# EasyEDA Pro project myg102.eprj

# Schematic Schematic1
Board Name: Board1; Create Date: 2025-02-24; Page Name: P1; Project Name: myg102; Schematic Name: Schematic1; Update Date: 2025-06-20; Company: 嘉立创EDA; Page Size: A4; Version: V1.0
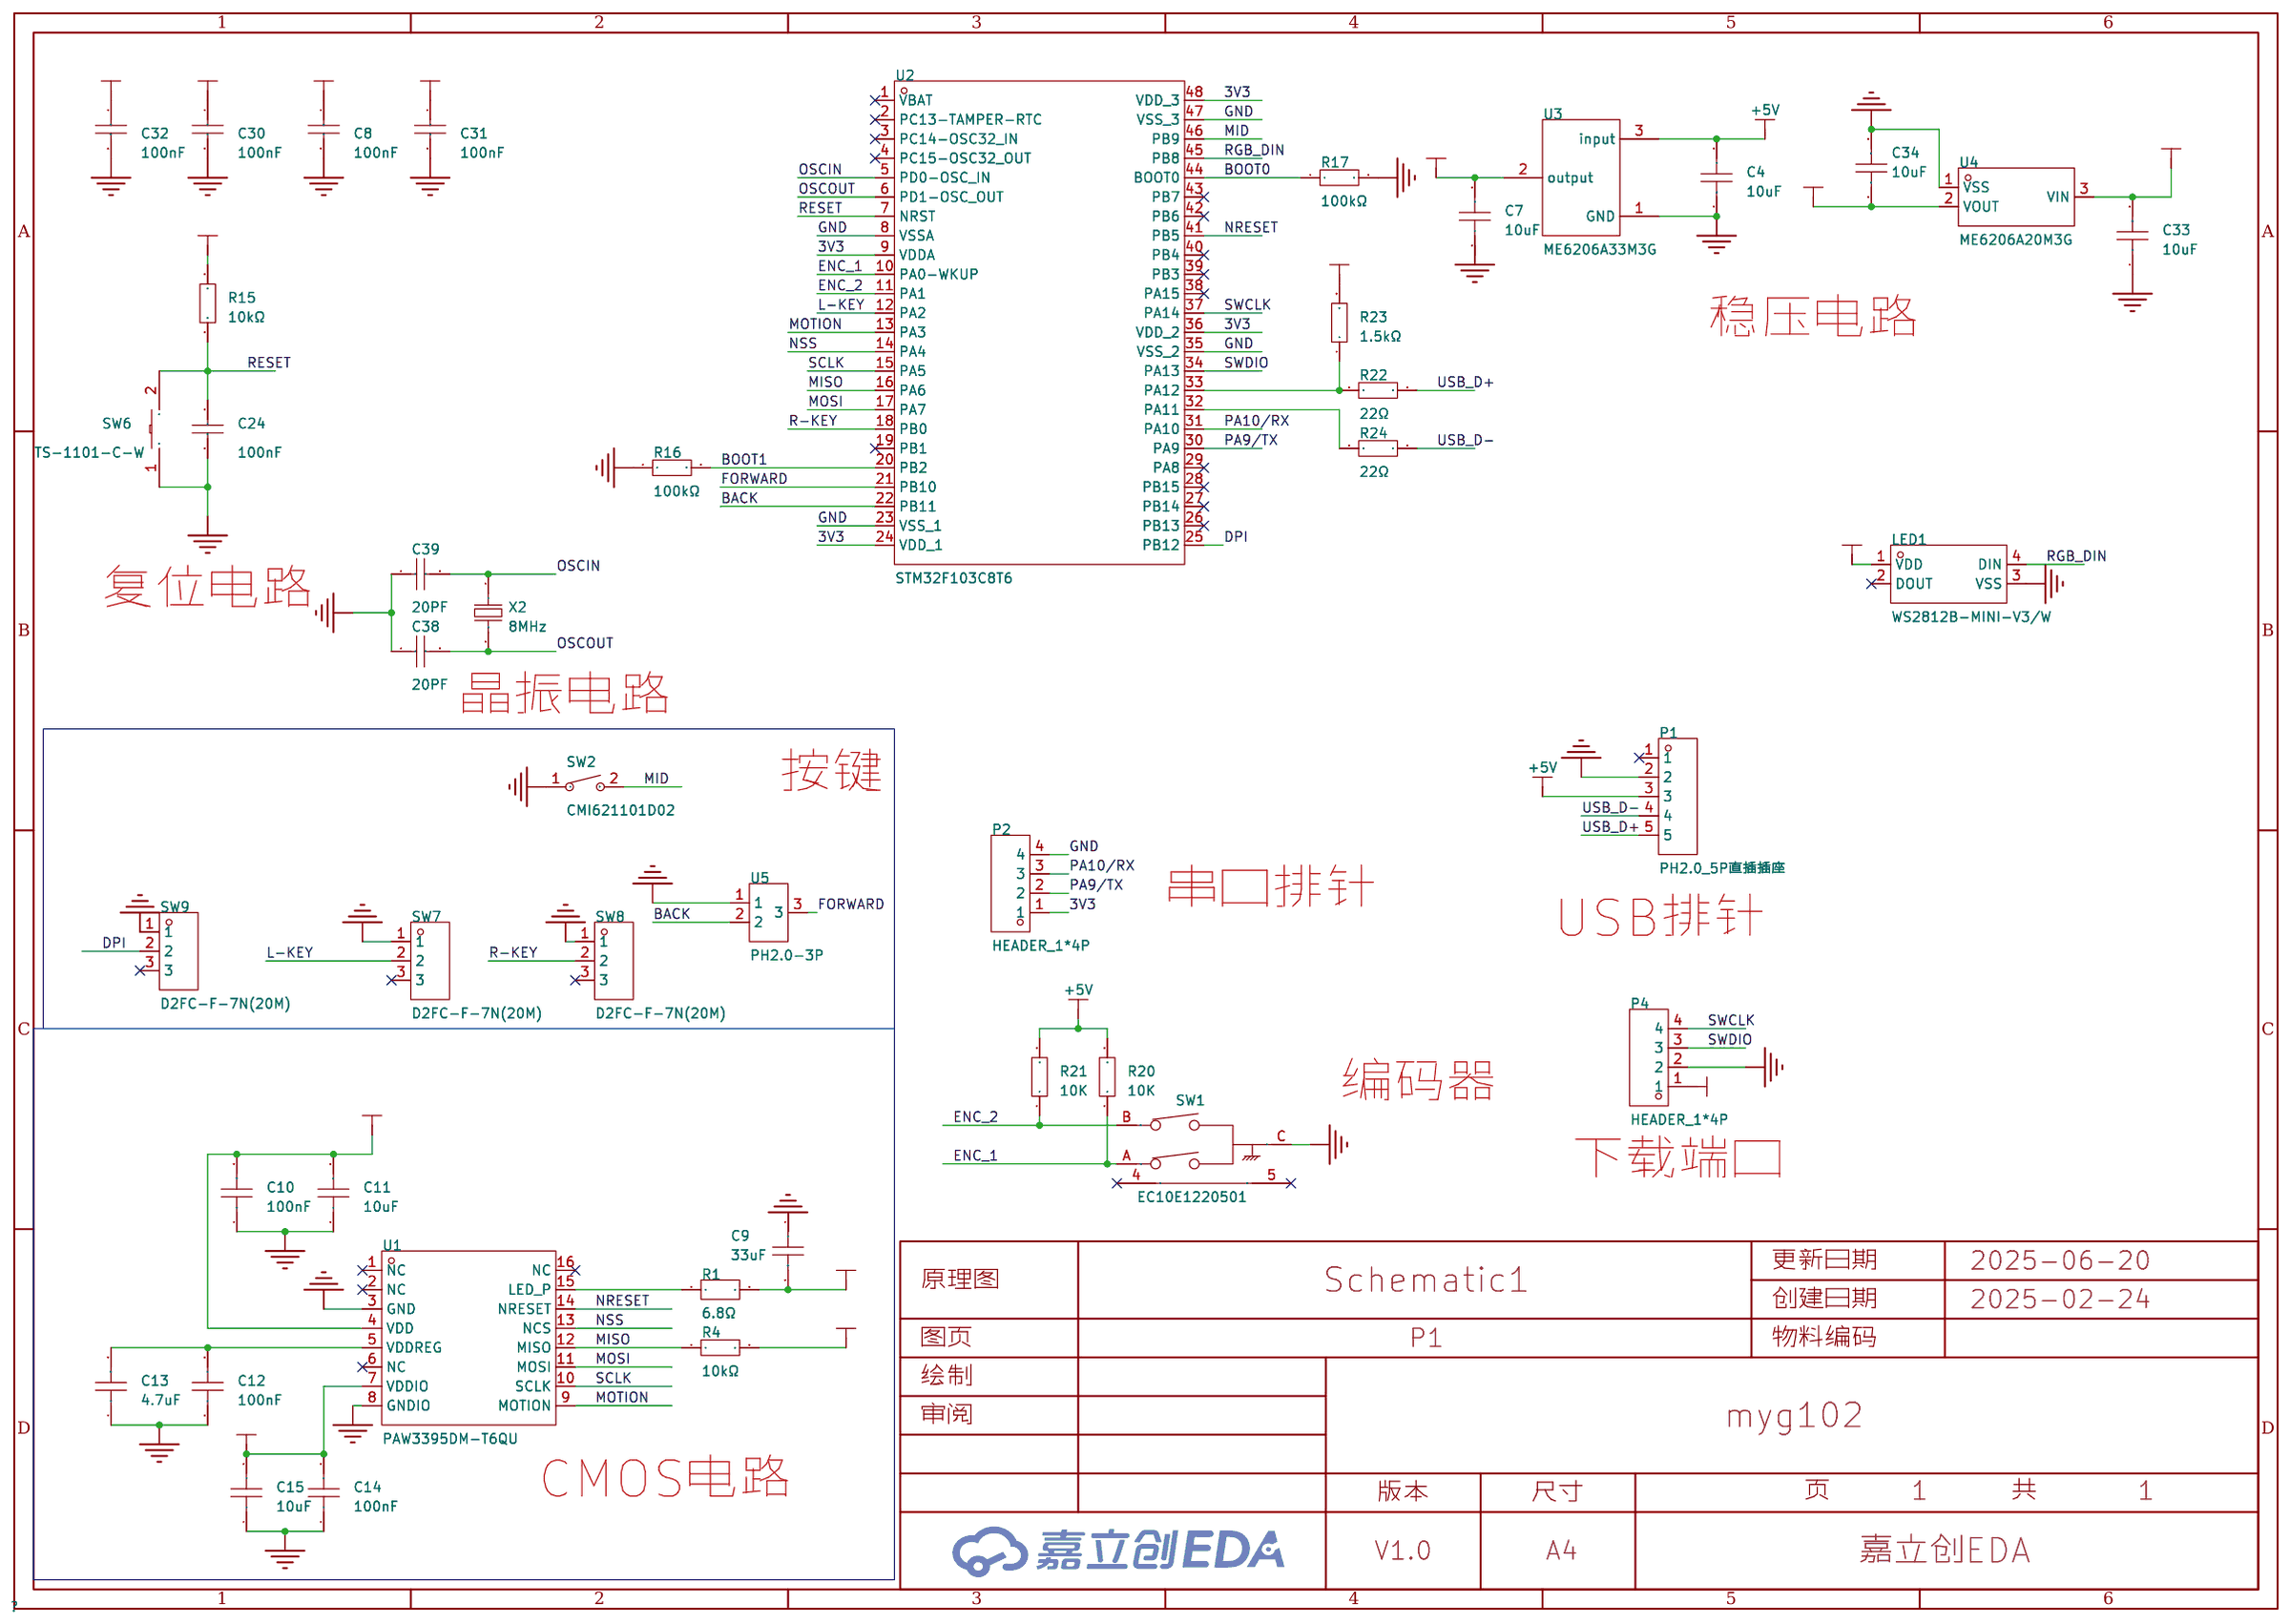
[diagram p0: schematic sheet]

## Parts
C4  10uF  [C0603]
C7  10uF  [C0603]
C8  100nF  [C0603]
C9  33uF  [C0603]
C10  100nF  [C0603]
C11  10uF  [C0603]
C12  100nF  [C0603]
C13  4.7uF  [C0603]
C14  100nF  [C0603]
C15  10uF  [C0603]
C24  100nF  [C0603]
C30  100nF  [C0603]
C31  100nF  [C0603]
C32  100nF  [C0603]
C33  10uF  [C0603]
C34  10uF  [C0603]
C38  20PF  [C0603]
C39  20PF  [C0603]
LED1  WS2812B-MINI-V3/W  [LED-SMD_4P-L3.5-W3.5-TL_WS2812B]
P1  PH2.0_5P直插插座  [CONN-TH_5P-P2.00-PH5A]
P2  HEADER_1*4P  [HDR-TH_4P-P2.54-V-M-1]
P4  HEADER_1*4P  [HDR-TH_4P-P2.54-V-M-1]
R1  6.8Ω  [R0603]
R4  10kΩ  [R0603]
R15  10kΩ  [R0603]
R16  100kΩ  [R0603]
R17  100kΩ  [R0603]
R20  10K  [R0603]
R21  10K  [R0603]
R22  22Ω  [R0603]
R23  1.5kΩ  [R0603]
R24  22Ω  [R0603]
SW1  EC10E1220501  [SW-TH_EC10EXXXXXXX]
SW2  CMI621101D02  [SW-TH_L6.2-W6.2-P5.00]
SW6  TS-1101-C-W  [SW-SMD_L6.0-W3.3-LS8.0]
SW7  D2FC-F-7N(20M)  [SW-TH_3P-L12.8-W5.8-P5.08_DM3CQF1004L04]
SW8  D2FC-F-7N(20M)  [SW-TH_3P-L12.8-W5.8-P5.08_DM3CQF1004L04]
SW9  D2FC-F-7N(20M)  [SW-TH_3P-L12.8-W5.8-P5.08_DM3CQF1004L04]
U1  PAW3395DM-T6QU  [DIP-16_PAW3395DM-T6QU]
U2  STM32F103C8T6  [LQFP-48_L7.0-W7.0-P0.50-LS9.0-BL]
U3  ME6206A33M3G  [SOT-23-3_L2.9-W1.6-P1.90-LS2.8-BR]
U4  ME6206A20M3G  [SOT-23-3_L3.0-W1.7-P0.95-LS2.9-BR]
U5  PH2.0-3P  [CONN-TH_3P-P2.00_HX20007-3A]
X2  8MHz  [CRYSTAL-SMD_2P-L5.0-W3.2]

## Library data of the parts
C4 C7 C9 C33 C34 = CAP_0603: Supplier Footprint: 0603
C8 C24 C30-C32 C38 C39 = 0603B104K500NT: 容值:100nF;精度:±10%;额定电压:50V;材质(温度系数):X7R;; LCSC Part Name: 100nF ±10% 50V; Supplier Part: C30926; Manufacturer: FH(风华); Supplier Footprint: 0603; JLCPCB Part Class: 扩展库; Datasheet: https://atta.szlcsc.com/upload/public/pdf/source/20170923/C30926_1506149436298988724.pdf; Supplier: LCSC; Tolerance: ±10%; Voltage Rated: 50V; Temperature Coefficient: X7R
C10 C12 C14 = CC0603KRX7R9BB104: 容值:100nF;精度:±10%;额定电压:50V;材质(温度系数):X7R;; LCSC Part Name: 100nF ±10% 50V; Supplier Part: C14663; Manufacturer: YAGEO(国巨); Supplier Footprint: 0603; JLCPCB Part Class: Basic Part; Datasheet: https://atta.szlcsc.com/upload/public/pdf/source/20180910/C282072_33301C7F631E79921B82A8DAC6BCC5B3.pdf; Supplier: LCSC; Tolerance: ±10%; Voltage Rated: 50V; Temperature Coefficient: X7R
C11 C15 = CL10A106MA8NRNC: LCSC Part Name: 10uF ±20% 25V; Supplier Part: C96446; Manufacturer: SAMSUNG(三星); Supplier Footprint: 0603; JLCPCB Part Class: 基础库; Datasheet: https://atta.szlcsc.com/upload/public/pdf/source/20160218/1457707763339.pdf; Supplier: LCSC; Tolerance: ±20%; Voltage Rated: 25V; Temperature Coefficient: X5R
C13 = CL10A475KO8NNNC: 容值:4.7uF;精度:±10%;额定电压:16V;材质(温度系数):X5R;; LCSC Part Name: 4.7uF ±10% 16V; Supplier Part: C19666; Manufacturer: SAMSUNG(三星); Supplier Footprint: 0603; JLCPCB Part Class: Basic Part; Datasheet: https://atta.szlcsc.com/upload/public/pdf/source/20160218/1457707763339.pdf; Supplier: LCSC; Tolerance: ±10%; Voltage Rated: 16V; Temperature Coefficient: X5R
LED1 = WS2812B-MINI-V3/W: LCSC Part Name: RGB三色; Supplier Part: C527089; Manufacturer: worldsemi; Supplier Footprint: SMD3535; JLCPCB Part Class: 扩展库; Datasheet: https://atta.szlcsc.com/upload/public/pdf/source/20190620/C114583_ECCAEB884D1CBA01F5696FFC90F90D84.pdf; Supplier: LCSC
P1 = PH2.0_5P直插插座: Supplier Part: C2932788; Supplier Footprint: TH-5P; JLCPCB Part Class: 扩展库; Supplier: LCSC
P2 P4 = HEADER_1*4P: Supplier Part: C9900003200; Supplier Footprint: TH-4P; JLCPCB Part Class: 扩展库; Datasheet: https://atta.szlcsc.comnull; Supplier: LCSC
R1 = FRC0603F5R60TS: LCSC Part Name: 5.6Ω ±1% 100mW 厚膜电阻; Supplier Part: C2933244; Manufacturer: FOJAN(富捷); Supplier Footprint: 0603; JLCPCB Part Class: 扩展库; Datasheet: https://atta.szlcsc.com/upload/public/pdf/source/20211221/925EC7D7225764EE0046F22065062C87.pdf; Supplier: LCSC; Type: 厚膜电阻; Tolerance: ±1%; Power(Watts): 100mW; Overload Voltage (Max): 75V; Temperature Coefficient: ±200ppm/℃; Operating Temperature Range: -55℃~+155℃
R4 R15 = 0603WAF1002T5E: LCSC Part Name: 厚膜电阻 10kΩ ±1% 100mW; Supplier Part: C25804; Manufacturer: UNI-ROYAL(厚声); Supplier Footprint: 0603; JLCPCB Part Class: 基础库; Datasheet: https://atta.szlcsc.com/upload/public/pdf/source/20200306/C422600_1E6D84923E4A46A82E41ADD87F860B5C.pdf; Supplier: LCSC; Type: 厚膜电阻; Tolerance: ±1%; Power(Watts): 100mW; Overload Voltage (Max): 75V; Temperature Coefficient: ±100ppm/℃; Operating Temperature Range: -55℃~+155℃
R16 R17 R23 = 0603WAF1003T5E: LCSC Part Name: 100kΩ ±1% 100mW 厚膜电阻; Supplier Part: C25803; Manufacturer: UNI-ROYAL(厚声); Supplier Footprint: 0603; JLCPCB Part Class: 基础库; Datasheet: https://atta.szlcsc.com/upload/public/pdf/source/20200306/C422600_1E6D84923E4A46A82E41ADD87F860B5C.pdf; Supplier: LCSC; Type: 厚膜电阻; Tolerance: ±1%; Power(Watts): 100mW; Overload Voltage (Max): 75V; Temperature Coefficient: ±100ppm/℃; Operating Temperature Range: -55℃~+155℃
R20 R21 = Res_0603: Supplier Footprint: 0603
R22 R24 = 0603WAF1001T5E: LCSC Part Name: 1kΩ ±1% 100mW 厚膜电阻; Supplier Part: C21190; Manufacturer: UNI-ROYAL(厚声); Supplier Footprint: 0603; JLCPCB Part Class: 基础库; Datasheet: https://atta.szlcsc.com/upload/public/pdf/source/20200306/C422600_1E6D84923E4A46A82E41ADD87F860B5C.pdf; Supplier: LCSC; Type: 厚膜电阻; Tolerance: ±1%; Power(Watts): 100mW; Overload Voltage (Max): 75V; Temperature Coefficient: ±100ppm/℃; Operating Temperature Range: -55℃~+155℃
SW1 = EC10E1220501: 10型贯通轴型; Supplier Part: C160889; Manufacturer: ALPSALPINE(阿尔卑斯阿尔派); Supplier Footprint: 插件; JLCPCB Part Class: 扩展库; Datasheet: https://atta.szlcsc.com/upload/public/pdf/source/20180227/C160889_15197014267581370273.pdf; Supplier: LCSC
SW2 = CMI621101D02: Supplier Part: C400270; Manufacturer: Kailh(凯华); Supplier Footprint: 插件; JLCPCB Part Class: 扩展库; Datasheet: https://atta.szlcsc.com/upload/public/pdf/source/20190626/C400270_3457BBCDA2CC0541E03549A09232DE51.pdf; Supplier: LCSC
SW6 = TS-1101-C-W: 触点电流:50mA;额定电压(AC):-;额定电压(DC):12V;额定功率:-;绝缘电阻:-;电路结构:单刀单掷;安装方式:立贴;带灯:无;作用力:260gf;机械寿命:5万次;带支架:否;; LCSC Part Name: 立贴 6*3.6*2.5mm 轻触开关 一型3*6*2.5有白ZD b拉伸白色带淡绿按键 卷装; Supplier Part: C318938; Manufacturer: XKB Connectivity(中国星坤); Supplier Footprint: SMD; JLCPCB Part Class: 扩展库; Datasheet: https://atta.szlcsc.com/upload/public/pdf/source/20200227/C318938_C2E53B1EEDE37D980A33616AC086DE53.pdf; Supplier: LCSC; Contact Current: 50mA; Voltage Rating (DC): 12V; Circuit: 单刀单掷; Mounting Style: 立贴; Actuator Style: 矩形按钮; Actuator/Cap Color: 白色带淡绿; With Lamp: 无; Operating Force: 260gf; Mechanical Life: 5万次; Operating Temperature: -30℃~+85℃; Switch Length: 6mm; Switch Width: 3.6mm; Switch Height: 2.5mm; Strike Gundam: 否
SW7-SW9 = D2FC-F-7N(20M): LCSC Part Name: 轻触开关; Supplier Part: C5157566; Manufacturer: OMRON(欧姆龙); Supplier Footprint: 插件; JLCPCB Part Class: 扩展库; Datasheet: https://atta.szlcsc.com/upload/public/pdf/source/20240115/28CA2E1BAA5194B1D9F718083413D459.pdf; Supplier: LCSC
U1 = PAW3395DM-T6QU: Supplier Part: C9900026543; Supplier Footprint: 16-PDIP; Supplier: LCSC; Check: false
U2 = STM32F103C8T6: LCSC Part Name: 主流增强型ARM Cortex-M3 MCU，具有64 KB Flash、72 MHz CPU、电机控制、USB和CAN; Supplier Part: C8734; Manufacturer: ST(意法半导体); Supplier Footprint: LQFP-48(7x7); JLCPCB Part Class: 扩展库; Datasheet: https://atta.szlcsc.com/upload/public/pdf/source/20220812/8363ACEC51AD55ECEB84799464F7CB85.pdf; Supplier: LCSC; CPU Core: ARM-M3; CPU Maximum Speed: 72MHz; Program Storage Size: 64KB; Program Memory Type: FLASH; Number of I/O: 37; ADC (Bit): 12bit; Low Voltage Detection Threshold: 2V~3.6V
U3 = ME6206A33M3G: LCSC Part Name: 输入6V 输出3.3V 300mA; Supplier Part: C35259; Manufacturer: MICRONE(南京微盟); Supplier Footprint: SOT-23-3L; JLCPCB Part Class: 扩展库; Datasheet: https://atta.szlcsc.com/upload/public/pdf/source/20160727/1469591428238.pdf; Supplier: LCSC; Output Type: 固定; Maximum Input Voltage: 6V; Output Voltage: 3.3V; MAX Output Current: 300mA; Power Supply Rejection Ratio (PSRR): 50dB@(1kHz); Dropout Voltage: 380mV@(200mA); Output Polarity: 正极; Number of Outputs: 1
U4 = ME6206A20M3G: LCSC Part Name: 输入6V 输出2V; Supplier Part: C128056; Manufacturer: MICRONE(南京微盟); Supplier Footprint: SOT-23; JLCPCB Part Class: 扩展库; Datasheet: https://atta.szlcsc.com/upload/public/pdf/source/20180709/C236710_17D59B8921B23E717C74E2DD8882F2F4.pdf; Supplier: LCSC; Output Type: 固定; Maximum Input Voltage: 6V; Output Voltage: 2V; Power Supply Rejection Ratio (PSRR): 45dB@(1kHz); Output Polarity: 正极; Number of Outputs: 1
U5 = PH2.0-3P: Supplier Part: C9900011646; Supplier Footprint: HY2.0-3A; JLCPCB Part Class: 扩展库; Supplier: LCSC
X2 = XG1SI-111-8M: LCSC Part Name: 8MHz ±10ppm 20pF; Supplier Part: C20415366; Manufacturer: YXC(扬兴晶振); Supplier Footprint: SMD5032-2P; JLCPCB Part Class: 扩展库; Datasheet: https://atta.szlcsc.com/upload/public/pdf/source/20240329/44922B0AF7B60E58E9B66993B6077277.pdf; Supplier: LCSC; Crystal Type: 贴片晶振; Normal temperature Frequency Tolerance: ±10ppm; Load Capacitor: 20pF; Frequency Stability(Full temperature range): ±20ppm; Operating Temperature: -40℃~+85℃

## Nets
2V: C9.2 C10.2 C11.2 C34.1 R1.2 U1.4(VDD) U4.2(VOUT)
3V3: C7.2 C8.1 C14.2 C15.2 C30.1 C31.1 C32.1 C33.2 P2.1 P4.1 R4.2 R15.2 R23.2 U1.7(VDDIO) U2.9(VDDA) U2.24(VDD_1) U2.36(VDD_2) U2.48(VDD_3) U3.2(output) U4.3(VIN)
+5V: C4.2 LED1.1(VDD) P1.3 R20.2 R21.2 U3.3(input)
GND: C4.1 C7.1 C8.2 C9.1 C10.1 C11.1 C12.1 C13.1 C14.1 C15.1 C24.1 C30.2 C31.2 C32.2 C33.1 C34.2 C38.1 C39.1 LED1.3(VSS) P1.2 P2.4 P4.2 R16.1 R17.2 SW1.C SW2.1 SW6.1 SW7.1 SW8.1 SW9.1 U1.3(GND) U1.8(GNDIO) U2.8(VSSA) U2.23(VSS_1) U2.35(VSS_2) U2.47(VSS_3) U3.1(GND) U4.1(VSS) U5.1
BACK: U2.22(PB11) U5.2
BOOT0: R17.1 U2.44(BOOT0)
BOOT1: R16.2 U2.20(PB2)
DPI: SW9.2 U2.25(PB12)
ENC_1: R20.1 SW1.A U2.10(PA0-WKUP)
ENC_2: R21.1 SW1.B U2.11(PA1)
FORWARD: U2.21(PB10) U5.3
L-KEY: SW7.2 U2.12(PA2)
MID: SW2.2 U2.46(PB9)
MISO: R4.1 U1.12(MISO) U2.16(PA6)
MOSI: U1.11(MOSI) U2.17(PA7)
MOTION: U1.9(MOTION) U2.13(PA3)
NRESET: U1.14(NRESET) U2.41(PB5)
NSS: U1.13(NCS) U2.14(PA4)
OSCIN: C39.2 U2.5(PD0-OSC_IN) X2.1
OSCOUT: C38.2 U2.6(PD1-OSC_OUT) X2.2
PA9/TX: P2.2 U2.30(PA9)
PA10/RX: P2.3 U2.31(PA10)
R-KEY: SW8.2 U2.18(PB0)
RESET: C24.2 R15.1 SW6.2 U2.7(NRST)
RGB_DIN: LED1.4(DIN) U2.45(PB8)
SCLK: U1.10(SCLK) U2.15(PA5)
SWCLK: P4.4 U2.37(PA14)
SWDIO: P4.3 U2.34(PA13)
USB_D+: P1.5 R22.2
USB_D-: P1.4 R24.2
$1N536: R1.1 U1.15(LED_P)
$1N4221: C12.2 C13.2 U1.5(VDDREG)
$1N8049: R22.1 R23.1 U2.33(PA12)
$1N8234: R24.1 U2.32(PA11)

Not connected (* = marked no-connect by the designer): LED1 2(DOUT)*; P1 1*; SW1 4* 5*; SW7 3*; SW8 3*; SW9 3*; U1 1(NC)* 2(NC)* 6(NC)* 16(NC)*; U2 1(VBAT)* 2(PC13-TAMPER-RTC)* 3(PC14-OSC32_IN)* 4(PC15-OSC32_OUT)* 19(PB1)* 26(PB13)* 27(PB14)* 28(PB15)* 29(PA8)* 38(PA15)* 39(PB3)* 40(PB4)* 42(PB6)* 43(PB7)*

## Notes on the sheet
- 稳压电路
- 复位电路
- 晶振电路
- 按键
- 串口排针
- USB排针
- 编码器
- 下载端口
- CMOS电路

# Board PCB1
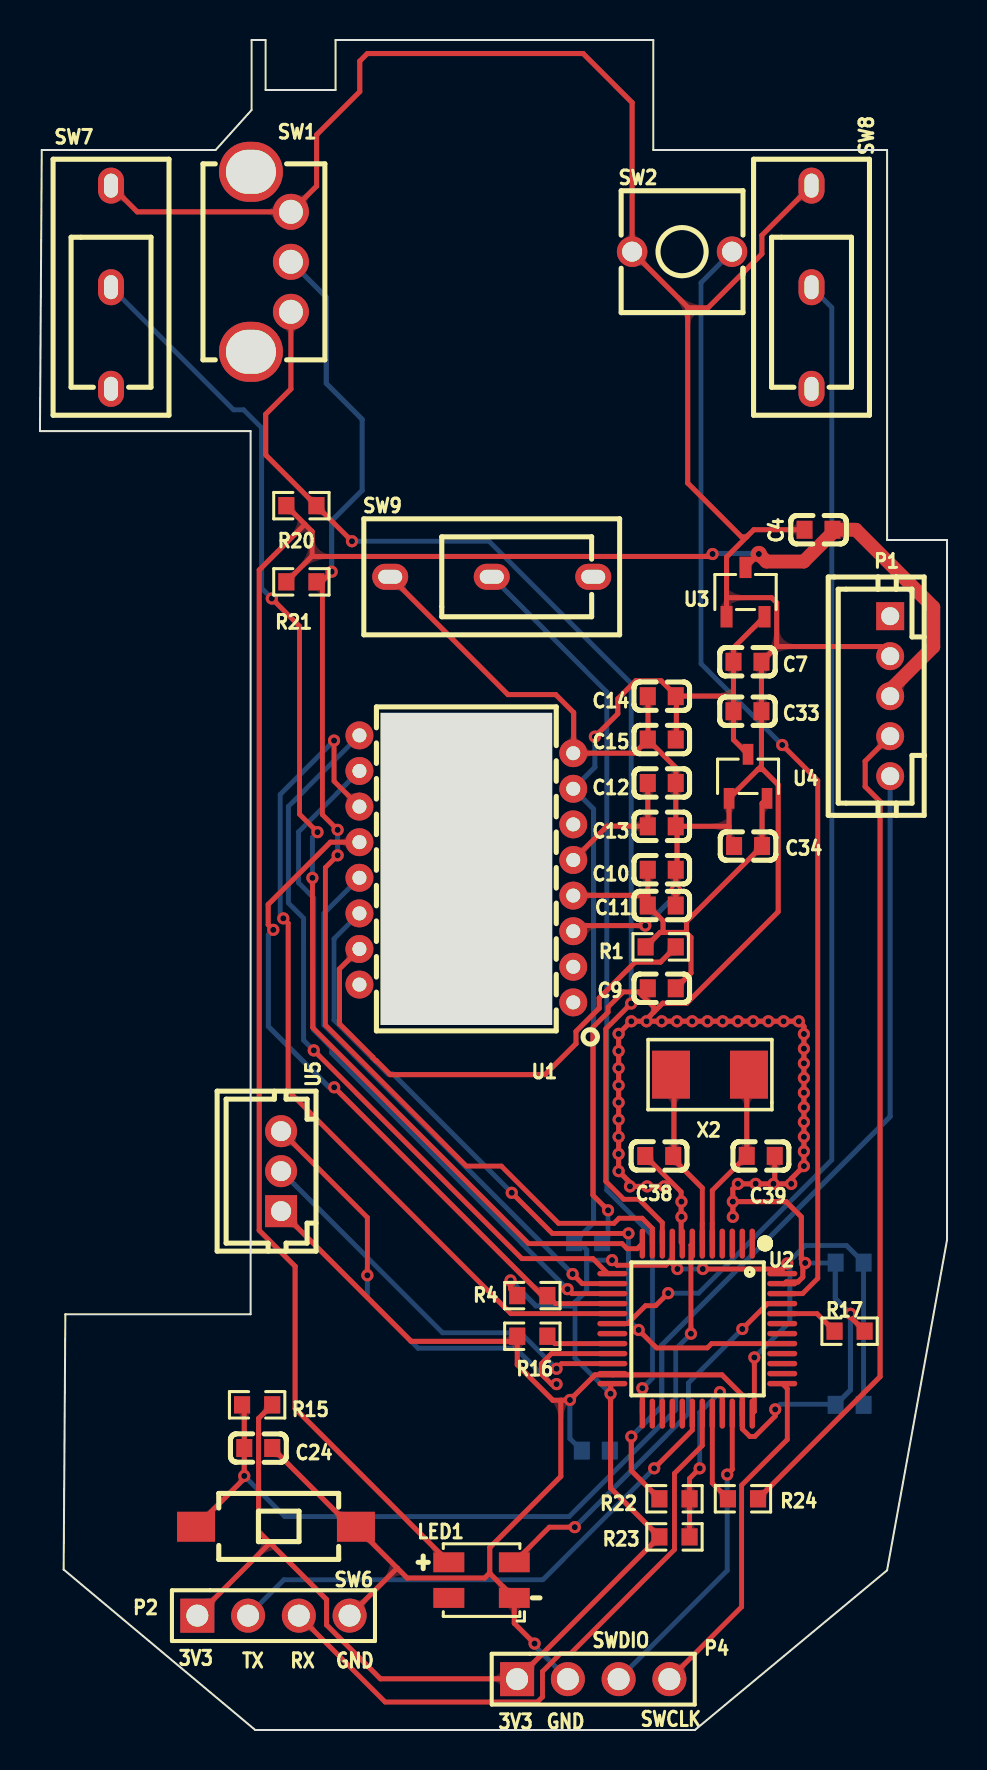
[diagram p1: board, top side]
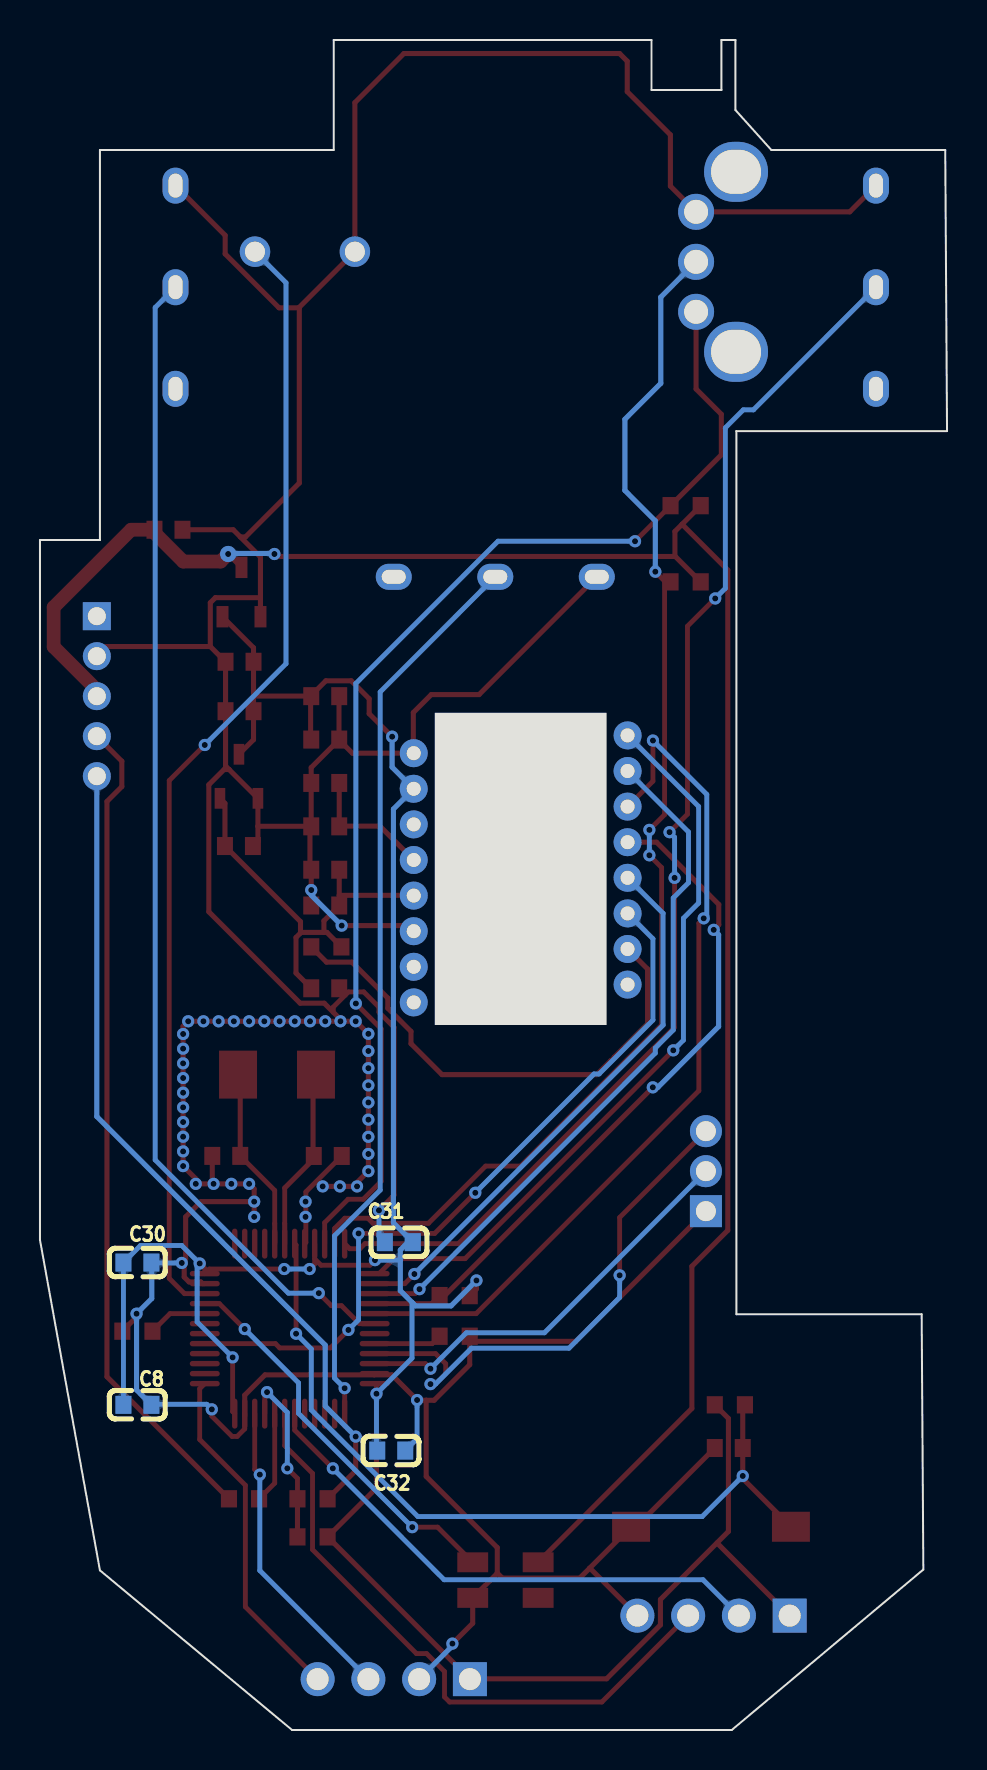
[diagram p2: board, bottom side, seen from below]

Outline 45.39 x 84.5 mm; copper layers: Top Layer, Bottom Layer. Coordinates in mm from the lower left corner of the outline.
Outline path: 0,64.94 10.54,64.94 10.54,20.79 1.27,20.79 1.19,8.02 10.77,0 32.77,0 42.39,7.98 45.39,24.5 45.39,59.5 42.39,59.5 42.39,79 30.69,79 30.69,84.5 14.79,84.5 14.79,82 11.29,82 11.29,84.5 10.59,84.5 10.59,81 8.79,79 0.09,79 0,64.94
Stack: Top Layer 0.035mm / Dielectric1 1.51mm FR4 er 4.5 / Bottom Layer 0.035mm

## Design rules (mm)
net OSCOUT: DP1
net OSCIN: DP1
template: JLCPCB Capability(Two Layers Board)
spacing copperThickness1oz (default): track to track 0.102, other pairs 0.152 to 0.3
spacing copperThickness2oz: track to track 0.203, other pairs 0.152 to 0.3
track width copperThickness1oz (default): min 0.127, default 0.254, max 2.54
track width copperThickness2oz: min 0.203, default 0.254, max 2.54
differential pair differentialPair (default): width min 0.127, default 0.254, max 2.54; gap min 0.152, default 0.152
via viaSize (default): diameter min 0.5, default 0.61, max 10; hole min 0.3, default 0.305, max 6.3

## Placement (name value [footprint] x y rotation side)
C4  10uF  [C0603]  38.96 60.01 0 top
C7  10uF  [C0603]  35.4 53.41 180 top
C8  100nF  [C0603]  40.51 16.26 180 bottom
C9  33uF  [C0603]  31.11 37.09 0 top
C10  100nF  [C0603]  31.11 43.01 180 top
C11  10uF  [C0603]  31.11 41.23 180 top
C12  100nF  [C0603]  31.11 47.35 180 top
C13  4.7uF  [C0603]  31.11 45.18 180 top
C14  100nF  [C0603]  31.11 51.69 0 top
C15  10uF  [C0603]  31.11 49.52 0 top
C24  100nF  [C0603]  10.92 14.1 180 top
C30  100nF  [C0603]  40.51 23.37 180 bottom
C31  100nF  [C0603]  27.43 24.39 0 bottom
C32  100nF  [C0603]  27.81 13.97 180 bottom
C33  10uF  [C0603]  35.4 50.94 180 top
C34  10uF  [C0603]  35.43 44.2 180 top
C38  20PF  [C0603]  30.99 28.7 0 top
C39  20PF  [C0603]  36.07 28.7 180 top
LED1  WS2812B-MINI-V3/W  [LED-SMD_4P-L3.5-W3.5-TL_WS2812B]  22.1 7.5 0 top
P1  PH2.0_5P直插插座  [CONN-TH_5P-P2.00-PH5A]  42.55 51.69 270 top
P2  HEADER_1*4P  [HDR-TH_4P-P2.54-V-M-1]  11.68 5.72 0 top
P4  HEADER_1*4P  [HDR-TH_4P-P2.54-V-M-1]  27.69 2.54 0 top
R1  6.8Ω  [R0603]  31.06 39.16 180 top
R4  10kΩ  [R0603]  24.64 21.72 180 top
R15  10kΩ  [R0603]  10.87 16.26 0 top
R16  100kΩ  [R0603]  24.64 19.69 0 top
R17  100kΩ  [R0603]  40.51 19.94 0 top
R20  10K  [R0603]  13.08 61.22 180 top
R21  10K  [R0603]  13.08 57.41 180 top
R22  22Ω  [R0603]  31.75 11.56 180 top
R23  1.5kΩ  [R0603]  31.75 9.65 180 top
R24  22Ω  [R0603]  35.18 11.56 0 top
SW1  EC10E1220501  [SW-TH_EC10EXXXXXXX]  11.56 73.41 90 top
SW2  CMI621101D02  [SW-TH_L6.2-W6.2-P5.00]  32.13 73.92 0 top
SW6  TS-1101-C-W  [SW-SMD_L6.0-W3.3-LS8.0]  11.81 10.16 180 top
SW7  D2FC-F-7N(20M)  [SW-TH_3P-L12.8-W5.8-P5.08_DM3CQF1004L04]  3.56 72.14 270 top
SW8  D2FC-F-7N(20M)  [SW-TH_3P-L12.8-W5.8-P5.08_DM3CQF1004L04]  38.61 72.14 270 top
SW9  D2FC-F-7N(20M)  [SW-TH_3P-L12.8-W5.8-P5.08_DM3CQF1004L04]  22.61 57.66 0 top
U1  PAW3395DM-T6QU  [DIP-16_PAW3395DM-T6QU]  21.34 43.06 180 top
U2  STM32F103C8T6  [LQFP-48_L7.0-W7.0-P0.50-LS9.0-BL]  32.89 20.07 180 top
U3  ME6206A33M3G  [SOT-23-3_L2.9-W1.6-P1.90-LS2.8-BR]  35.31 56.9 270 top
U4  ME6206A20M3G  [SOT-23-3_L3.0-W1.7-P0.95-LS2.9-BR]  35.43 47.68 270 top
U5  PH2.0-3P  [CONN-TH_3P-P2.00_HX20007-3A]  12.07 27.94 270 top
X2  8MHz  [CRYSTAL-SMD_2P-L5.0-W3.2]  33.53 32.77 180 top

## Footprints (pads in the part's own frame, mm; a bottom-side part is the same pattern mirrored in y, then rotated)
C0603
  rect 0.8x0.9 smd: 1(-0.7,0) 2(0.7,0)
CONN-TH_3P-P2.00_HX20007-3A
  rect 1.6x1.6 hole 1: 1(2,0)
  round 1.6 hole 1: 2(0,0) 3(-2,0)
CONN-TH_5P-P2.00-PH5A
  rect 1.4x1.4 hole 0.9: 1(-4,0)
  round 1.4 hole 0.9: 2(-2,0) 3(0,0) 4(2,0) 5(4,0)
CRYSTAL-SMD_2P-L5.0-W3.2
  rect 1.9x2.4 smd: 1(-1.95,0) 2(1.95,0)
DIP-16_PAW3395DM-T6QU
  round 1.4 hole 0.7: 1(-5.35,6.675) 2(-5.35,4.895) 3(-5.35,3.115) 4(-5.35,1.335) 5(-5.35,-0.445) 6(-5.35,-2.225) 7(-5.35,-4.005) 8(-5.35,-5.785) 9(5.35,-6.675) 10(5.35,-4.895) 11(5.35,-3.115) 12(5.35,-1.335) 13(5.35,0.445) 14(5.35,2.225) 15(5.35,4.005) 16(5.35,5.785)
HDR-TH_4P-P2.54-V-M-1
  rect 1.7x1.7 hole 1.1: 1(-3.81,0)
  round 1.7 hole 1.1: 2(-1.27,0) 3(1.27,0) 4(3.81,0)
LED-SMD_4P-L3.5-W3.5-TL_WS2812B
  rect 1.545x0.997 smd: 1(-1.637,0.89) 2(-1.637,-0.89) 3(1.637,-0.89) 4(1.637,0.89)
LQFP-48_L7.0-W7.0-P0.50-LS9.0-BL
  oval 0.27x1.5 smd: 1(-2.75,-4.25) 2(-2.25,-4.25) 3(-1.75,-4.25) 4(-1.25,-4.25) 5(-0.75,-4.25) 6(-0.25,-4.25) 7(0.25,-4.25) 8(0.75,-4.25) 9(1.25,-4.25) 10(1.75,-4.25) 11(2.25,-4.25) 12(2.75,-4.25) 25(2.75,4.25) 26(2.25,4.25) 27(1.75,4.25) 28(1.25,4.25) 29(0.75,4.25) 30(0.25,4.25) 31(-0.25,4.25) 32(-0.75,4.25) 33(-1.25,4.25) 34(-1.75,4.25) 35(-2.25,4.25) 36(-2.75,4.25)
  oval 1.5x0.27 smd: 13(4.25,-2.75) 14(4.25,-2.25) 15(4.25,-1.75) 16(4.25,-1.25) 17(4.25,-0.75) 18(4.25,-0.25) 19(4.25,0.25) 20(4.25,0.75) 21(4.25,1.25) 22(4.25,1.75) 23(4.25,2.25) 24(4.25,2.75) 37(-4.25,2.75) 38(-4.25,2.25) 39(-4.25,1.75) 40(-4.25,1.25) 41(-4.25,0.75) 42(-4.25,0.25) 43(-4.25,-0.25) 44(-4.25,-0.75) 45(-4.25,-1.25) 46(-4.25,-1.75) 47(-4.25,-2.25) 48(-4.25,-2.75)
R0603
  rect 0.806x0.864 smd: 1(-0.753,0) 2(0.753,0)
SOT-23-3_L2.9-W1.6-P1.90-LS2.8-BR
  rect 1.07x0.6 smd: 1(1.235,-0.95) 2(1.235,0.95) 3(-1.235,0)
SOT-23-3_L3.0-W1.7-P0.95-LS2.9-BR
  rect 1.038x0.532 smd: 1(1.101,-0.95) 2(1.101,0.95) 3(-1.101,0)
SW-SMD_L6.0-W3.3-LS8.0
  rect 1.9x1.5 smd: 1(-4,0) 2(4,0)
SW-TH_3P-L12.8-W5.8-P5.08_DM3CQF1004L04
  oval 1.8x1.3 hole 1.2x0.7: 1(-5.08,0) 2(0,0) 3(5.08,0)
SW-TH_EC10EXXXXXXX
  oval 3x3.2 hole 2.2x2.5: 4(-4.5,1) 5(4.5,1)
  round 1.8 hole 1.2: A(-2.5,-1) B(0,-1) C(2.5,-1)
SW-TH_L6.2-W6.2-P5.00
  round 1.524 hole 1: 1(-2.5,0) 2(2.5,0)

## Nets
As in the schematic.

Pads without a net: LED1 2; P1 1; SW1 4 5; SW7 3; SW8 3; SW9 3; U1 1 2 6 16; U2 1 2 3 4 19 26 27 28 29 38 39 40 42 43

## Via types
v1: diameter 0.61, hole 0.305, Top Layer to Bottom Layer, 92 vias
v2: diameter 0.81, hole 0.305, Top Layer to Bottom Layer, 1 via

## Routing (per net, layer and track width the routed paths; a pad name or vN(x,y) marks a point on that pad's centre or on a via; arc(x,y) is an arc through that point)
2V: length 21.1
  Top Layer w0.254: 31.18,39.88 32.32,39.88 32.35,39.85 ; 31.18,39.88 31.18,40.46 C11.2 30.42,41.73 ; 31.18,39.88 31.03,39.88 R1.2 ; 30.42,41.73 26.7,41.73 U1.4 ; 30.42,41.73 C10.2 ; U4.2 36.13,46.33 C34.1 32.35,40.42 32.35,39.85 ; 32.35,39.85 32.58,39.63 32.58,37.85 C9.2
3V3: length 141.1
  Top Layer w0.243: U2.24 28.55,17.23 v1(28.55,16.81) ; v1(31.9,23.05) 31.64,23.3 31.64,23.56 ; U2.36 35.75,15.92 v1(35.75,18.63) ; v1(28.63,23.49) 28.88,23.24 31.33,23.24 31.64,23.56 ; v1(33.17,23.05) 36.91,23.05 U2.48 37.14,23.07 v1(37.4,23.33) ; 31.64,23.56 U2.9
  Top Layer w0.254: 31.85,51.7 31.08,52.46 29.81,52.46 28.92,51.56 28.92,50.81 v1(27.77,49.67) ; 31.85,51.7 34.7,51.7 ; 31.85,51.7 31.85,49.55 C15.2 ; 31.85,51.7 31.82,51.7 ; 34.7,51.7 C7.2 34.7,54.11 U3.2 ; 34.7,51.7 C33.2 34.7,49.52 U4.3 ; 23.89,2.56 P4.1 ; 23.89,2.56 17.04,2.56 14.34,5.25 14.34,6.52 10.94,9.93 10.94,15.58 11.62,16.26 ; 23.89,2.56 30.99,9.65 ; 11.51,9.35 P2.1 ; v1(23.55,22.48) 23.55,22.06 R4.2 ; R23.2 28.55,12.1 v1(28.55,16.81)
  Bottom Layer w0.243: 37.53,23.46 37.53,20.41 v1(35.75,18.63) ; 37.53,23.46 38.3,24.22 40.36,24.22 C30.1 C8.1 ; 37.53,23.46 v1(37.4,23.33) ; 27.36,23.49 v1(28.63,23.49) ; v1(31.9,23.05) v1(33.17,23.05) ; C32.1 28.55,14.01 v1(28.55,16.81) 26.77,18.59 26.77,21.39
  Bottom Layer w0.254: 26.85,24.51 27.7,25.36 27.7,46.04 U1.7 27.77,48.14 v1(27.77,49.67) ; 26.85,24.51 27.36,24 27.36,21.97 26.6,21.21 24.82,21.21 v1(23.55,22.48) ; 26.85,24.51 C31.1
+5V: length 101.6
  Top Layer w0.254: 13.62,58.68 33.53,58.68 v1(33.66,58.8) ; 13.62,58.68 13.6,58.68 R21.2 ; 13.62,58.68 13.62,59.93 13.26,60.29 ; 13.26,60.29 R20.2 ; 13.26,60.29 10.97,58 10.97,24.98 12.77,23.18 12.77,16.08 LED1.1 ; v2(35.97,58.8) U3.3
  Top Layer w0.686: v2(35.97,58.8) 36.35,58.42 38.22,58.42 39.66,59.86 C4.2 40.83,60.01 44.7,56.14 44.7,54.16 42.55,52 P1.3
  Bottom Layer w0.254: v1(33.66,58.8) 33.68,58.83 35.95,58.83 v2(35.97,58.8)
GND: length 296.3
  Top Layer w0.243: 30.71,35.89 30.71,36.14 29.95,36.91 29.19,36.91 28.43,36.14 28.43,35.89 27.67,35.13 27.67,26.75 v1(28.43,25.98) ; C38.1 32.08,26.9 32.08,24.38 U2.8 ; v1(36.79,16.03) 36.79,15.69 35.78,14.68 35.52,14.68 35.14,15.06 35.14,15.73 ; 28.67,17.76 U2.23
  Top Layer w0.254: 22.51,7.85 22.51,7.83 23.74,6.61 23.74,5.34 v1(24.75,4.32) ; 22.51,7.85 22.25,7.6 18.38,7.6 17.88,8.09 ; 22.51,7.85 22.51,9.12 26.06,12.68 26.06,16.49 ; C4.1 35.72,60.01 35.36,59.65 ; U2.47 37.26,22.32 37.34,22.4 37.93,22.4 38.17,22.65 38.17,23.23 v1(38.29,23.35) 38.1,23.55 38.1,25.66 37.34,26.42 v1(34.67,26.42) ; 26.06,16.49 25.66,16.49 23.88,18.27 R16.1 23.63,19.43 18.57,19.43 U5.1 ; 26.06,16.49 26.51,16.49 27.78,17.76 34.13,17.76 35.14,16.74 U2.35 35.14,15.73 ; 31.88,45.19 31.82,45.19 31.82,48.12 30.43,49.51 ; 31.88,45.19 31.88,43.08 C10.1 v1(31.82,42) C11.1 ; 31.88,45.19 34.48,45.19 ; 34.48,45.19 34.48,44.45 C34.2 ; 34.48,45.19 U4.1 35.92,48.02 ; C24.1 15.56,10.16 SW6.1 17.88,8.09 ; SW8.1 36.12,74.73 36.12,73.8 33.43,71.11 32.41,71.11 ; 32.41,71.11 32.41,71.14 SW2.1 29.63,81.37 27.18,83.82 16.38,83.82 16,83.44 16,81.92 13.84,79.76 13.84,77.19 SW1.C 4.87,75.91 SW7.1 ; 32.41,71.11 32.41,62.35 35.11,59.65 35.36,59.65 ; v1(30.35,35.44) v1(31.11,35.44) v1(31.88,35.44) v1(32.64,35.44) v1(33.4,35.44) v1(34.16,35.44) v1(34.92,35.44) v1(35.69,35.44) v1(36.45,35.44) v1(37.21,35.44) v1(37.97,35.44) 38.23,35.18 v1(38.23,34.8) v1(38.23,34.07) v1(38.23,33.33) v1(38.23,32.6) v1(38.23,31.87) v1(38.23,31.13) v1(38.23,30.4) v1(38.23,29.66) v1(38.23,28.93) v1(38.23,28.2) 37.59,27.56 v1(37.59,27.31) v1(36.7,27.31) ; v1(40.56,20.81) 40.56,20.65 R17.2 ; 17.88,8.09 17.87,8.09 P2.4 ; v1(31.24,27.18) v1(30.38,27.18) v1(29.52,27.18) 29.52,27.38 v1(28.96,27.94) v1(28.96,28.8) v1(28.96,29.66) v1(28.96,30.52) v1(28.96,31.38) v1(28.96,32.23) v1(28.96,33.09) v1(28.96,33.95) v1(28.96,34.81) 29.58,35.44 v1(29.59,35.44) 30.29,35.44 30.29,35.47 31.16,36.34 32.37,36.34 36.94,40.91 36.94,47.26 36.18,48.02 35.92,48.02 ; 30.43,49.51 30.43,51.68 C14.1 ; 30.43,49.51 C15.1 ; 30.43,49.51 29.76,48.84 26.71,48.84 ; C39.1 36.77,27.37 v1(36.7,27.31) ; 34.36,56.62 U3.1 ; 34.36,56.62 34.36,58.65 35.36,59.65 ; 34.36,56.62 36.61,56.62 36.87,56.36 36.87,54.17 ; 35.92,48.02 36.1,48.2 C33.1 C7.1 36.87,54.17 ; v1(30.29,40.22) 26.96,40.22 U1.3 ; 36.87,54.17 42.06,54.17 P1.2 ; 26.71,48.84 26.71,50.87 25.81,51.77 23.42,51.77 SW9.1 ; 26.71,48.84 U1.8 ; v1(34.67,25.66) v1(34.67,26.42) ; v1(34.67,26.42) 34.67,27.05 v1(34.92,27.31) v1(35.81,27.31) v1(36.7,27.31)
  Bottom Layer w0.243: v1(38.29,23.35) 39.8,23.35 C30.2 ; C32.2 26.52,14.57 v1(26.52,16.5) ; C31.2 28.43,24.69 v1(28.43,25.98) ; 39.84,16.29 37.05,16.29 v1(36.79,16.03)
  Bottom Layer w0.254: v1(24.75,4.32) 24.75,4.21 26.42,2.54 ; v1(31.82,42) 31.82,41.74 v1(30.29,40.22) ; 39.8,23.35 39.8,21.58 v1(40.56,20.81) 40.56,17 C8.2
  vias: v1(32.1,26.42) v1(32.1,25.66)
BACK: length 20.8
  Top Layer w0.243: U2.22 26.1,18.32 v1(25.85,18.06)
  Bottom Layer w0.243: U5.2 20.15,19.86 24.05,19.86 v1(25.85,18.06)
BOOT0: length 3
  Top Layer w0.243: R17.1 38.88,20.82 U2.44
BOOT1: length 3.4
  Top Layer w0.243: U2.20 25.76,19.32 R16.2
DPI: length 45.4
  Top Layer w0.243: U2.25 v1(30.14,17.09)
  Bottom Layer w0.243: v1(30.14,17.09) 30.65,17.6 30.65,24.71 28.36,26.99 28.36,51.9 SW9.2
ENC_1: length 60.9
  Top Layer w0.243: U2.10 31.14,25.37 29.97,26.54 29.21,26.54 28.31,27.43 28.31,35.05 v1(29.58,36.32) ; R20.1 v1(15.61,59.44)
  Top Layer w0.254: SW1.A 12.56,67.05 11.29,65.79 11.29,63.76 R20.1
  Bottom Layer w0.243: v1(15.61,59.44) 22.47,59.44 29.58,52.33 v1(29.58,36.32)
ENC_2: length 62.9
  Top Layer w0.243: v1(14.9,43.74) 14.28,43.12 14.28,35.25 21.34,28.2 23.09,28.2 25.95,25.33 28.72,25.33 28.98,25.59 30.14,25.59 30.64,25.08 U2.11 ; v1(14.9,45.01) 14.13,45.77 14.13,57.45
  Top Layer w0.254: v1(14.6,57.91) 14.09,57.41 R21.1
  Bottom Layer w0.243: v1(14.9,45.01) v1(14.9,43.74)
  Bottom Layer w0.254: SW1.B 14.32,71.64 14.32,67.33 16.12,65.53 16.12,61.98 14.6,60.45 v1(14.6,57.91)
FORWARD: length 26.6
  Top Layer w0.243: v1(16.38,22.74) 16.38,25.62 U5.3 ; v1(25.85,17.29) 25.6,17.29 25.09,17.8 25.09,18.31 25.6,18.82 U2.21
  Bottom Layer w0.243: v1(25.85,17.29) 25.6,17.29 23.8,19.09 18.92,19.09 16.38,21.62 v1(16.38,22.74)
L-KEY: length 62.9
  Top Layer w0.243: v1(11.6,56.58) 12.99,55.19 12.99,45.79 v1(13.89,44.89) ; v1(13.63,42.61) 13.64,35.13 24.45,24.32 29.13,24.32 29.38,24.06 29.89,24.06 U2.12
  Bottom Layer w0.243: v1(13.63,42.61) 13.63,44.64 v1(13.89,44.89) ; v1(11.6,56.58) 11.09,57.08 11.09,65.11 10.2,66.01 9.69,66.01 SW7.2
MID: length 56.5
  Top Layer w0.243: U2.46 38.16,21.82 38.92,22.58 38.92,47.47 v1(37.14,49.25)
  Bottom Layer w0.243: SW2.2 33.08,72.36 33.08,53.31 v1(37.14,49.25)
MISO: length 35.1
  Top Layer w0.243: U2.16 25.79,21.32 R4.1
  Top Layer w0.254: R4.1 25.14,21.72 v1(14.72,32.13) ; U1.12 14.53,44.39 11.42,41.28 11.42,40.26 v1(11.68,40.01)
  Bottom Layer w0.254: v1(14.72,32.13) 14.47,32.13 11.43,35.17 11.43,39.76 v1(11.68,40.01)
MOSI: length 43.5
  Top Layer w0.243: U1.11 14.72,47.44 v1(14.72,49.47) ; U2.17 23.56,20.82 12.42,31.96 12.42,40.34 v1(12.18,40.58)
  Bottom Layer w0.243: v1(12.18,40.58) 12.02,40.74 12.02,46.78 v1(14.72,49.47)
MOTION: length 37.3
  Top Layer w0.243: U2.13 28.42,22.82 27.67,23.57 24.11,23.57 v1(13.7,33.98)
  Bottom Layer w0.243: U1.9 12.43,46.17 12.43,41.35 13.19,40.59 13.19,34.49 v1(13.7,33.98)
NRESET: length 37.7
  Top Layer w0.243: v1(29.96,20) 30.85,19.1 33.39,19.1 33.61,19.32 U2.41 ; v1(29.45,24.83) 25.64,24.83 v1(23.61,26.86)
  Bottom Layer w0.243: v1(29.45,24.83) 29.45,20.51 v1(29.96,20) ; U1.14 14.72,39.56 14.72,35.5 17.41,32.8 17.66,32.8 v1(23.61,26.86)
NSS: length 27.9
  Top Layer w0.243: U2.14 27.13,22.32 v1(26.65,22.8)
  Bottom Layer w0.243: v1(26.65,22.8) 14.21,35.24 14.21,40.83 U1.13
OSCIN: length 9.2
  Top Layer w0.243: C39.2 33.64,26.98 33.64,25.32
  Top Layer w0.254: X2.1 35.37,32.66 C39.2 ; U2.5 33.64,25.32
OSCOUT: length 9.2
  Top Layer w0.243: 31.73,28.66 C38.2 ; 33.14,25.32 33.14,27.1
  Top Layer w0.254: 33.14,27.1 31.69,28.56 C38.2 ; 31.73,28.66 31.73,32.62 31.58,32.77 ; U2.6 33.14,25.32
PA9/TX: length 26.9
  Top Layer w0.243: U2.30 32.64,14.99 v1(30.73,13.08)
  Bottom Layer w0.243: P2.2 12.21,7.51 25.16,7.51 v1(30.73,13.08)
PA10/RX: length 31.9
  Top Layer w0.243: U2.31 33.14,14.22 31.75,12.83 31.75,9.02 26.55,3.82 26.04,3.82 25.15,2.92 25.15,1.65 24.89,1.4 17.27,1.4 12.95,5.72
R-KEY: length 58.4
  Top Layer w0.243: U2.18 29.4,20.32 30.3,21.22 30.81,21.22 v1(31.44,21.84)
  Bottom Layer w0.243: v1(31.44,21.84) 32.96,21.84 39.62,28.51 39.62,71.12 SW8.2
RESET: length 40.4
  Top Layer w0.243: U2.7 32.57,24.25 v1(32.57,19.81)
  Top Layer w0.254: R15.1 10.22,16.15 10.22,12.57 SW6.2
  Bottom Layer w0.243: v1(32.57,19.81) 31.81,19.05 31.81,16 26.48,10.67 12.25,10.67 v1(10.22,12.7)
RGB_DIN: length 19.7
  Top Layer w0.243: v1(26.76,10.14) 25.49,10.14 LED1.4 ; U2.45 36.41,21.32 v1(35.14,20.05)
  Bottom Layer w0.243: v1(26.76,10.14) 32.45,15.83 32.45,17.35 v1(35.14,20.05)
SCLK: length 35.1
  Top Layer w0.243: U2.15 26.62,21.82 v1(26.4,22.04)
  Bottom Layer w0.243: U1.10 12.94,44.9 12.94,42.36 13.7,41.6 13.7,35 14.6,34.1 14.6,33.84 v1(26.4,22.04)
SWCLK: length 17.3
  Top Layer w0.243: P4.4 35.11,6.16 35.11,12.24 37.4,14.52 37.4,17.06 U2.37
SWDIO: length 15.6
  Top Layer w0.243: U2.34 34.64,13.02 v1(34.39,12.77)
  Bottom Layer w0.243: P4.3 34.39,7.98 v1(34.39,12.77)
USB_D+: length 42.1
  Top Layer w0.254: v1(29.59,14.67) 29.59,12.97 R22.2
  Bottom Layer w0.254: P1.5 42.55,30.67 31.11,19.24 31.11,16.2 v1(29.59,14.67)
USB_D-: length 41.5
  Top Layer w0.254: P1.4 41.29,48.44 41.29,47.17 42.04,46.43 42.04,17.66 R24.2
$1N536: length 25.3
  Top Layer w0.254: R1.1 31.05,38.39 29.78,38.39 27.98,36.6 27.98,36.09 26.82,34.93 26.82,34.32 25.27,32.77 17.53,32.77 16.83,33.46 16.81,33.46 16.65,33.63 16.65,33.65 14.99,35.31 14.99,38.05 U1.15
$1N4221: length 6.6
  Top Layer w0.254: 30.42,45.19 28.38,45.19 U1.5 ; 30.42,45.19 C12.2 ; 30.42,45.19 C13.2
$1N8049: length 9
  Top Layer w0.243: R22.1 32.5,12.58 v1(33.01,13.08) ; v1(34.03,16.89) 34.14,16.78 U2.33
  Top Layer w0.254: R22.1 R23.1
  Bottom Layer w0.243: v1(33.01,13.08) 33.01,15.88 v1(34.03,16.89)
$1N8234: length 4.6
  Top Layer w0.243: R24.1 33.64,12.34 U2.32

Small or netless copper shapes (teardrops, artwork), in the pictures only: 233 on Top Layer, 78 on Bottom Layer

## Text on the board
Top Silkscreen Layer: 3V3 | TX | RX | GND | SWDIO | SWCLK
